# EAGLE schematic Program Counter (EAGLE 9.5.2)
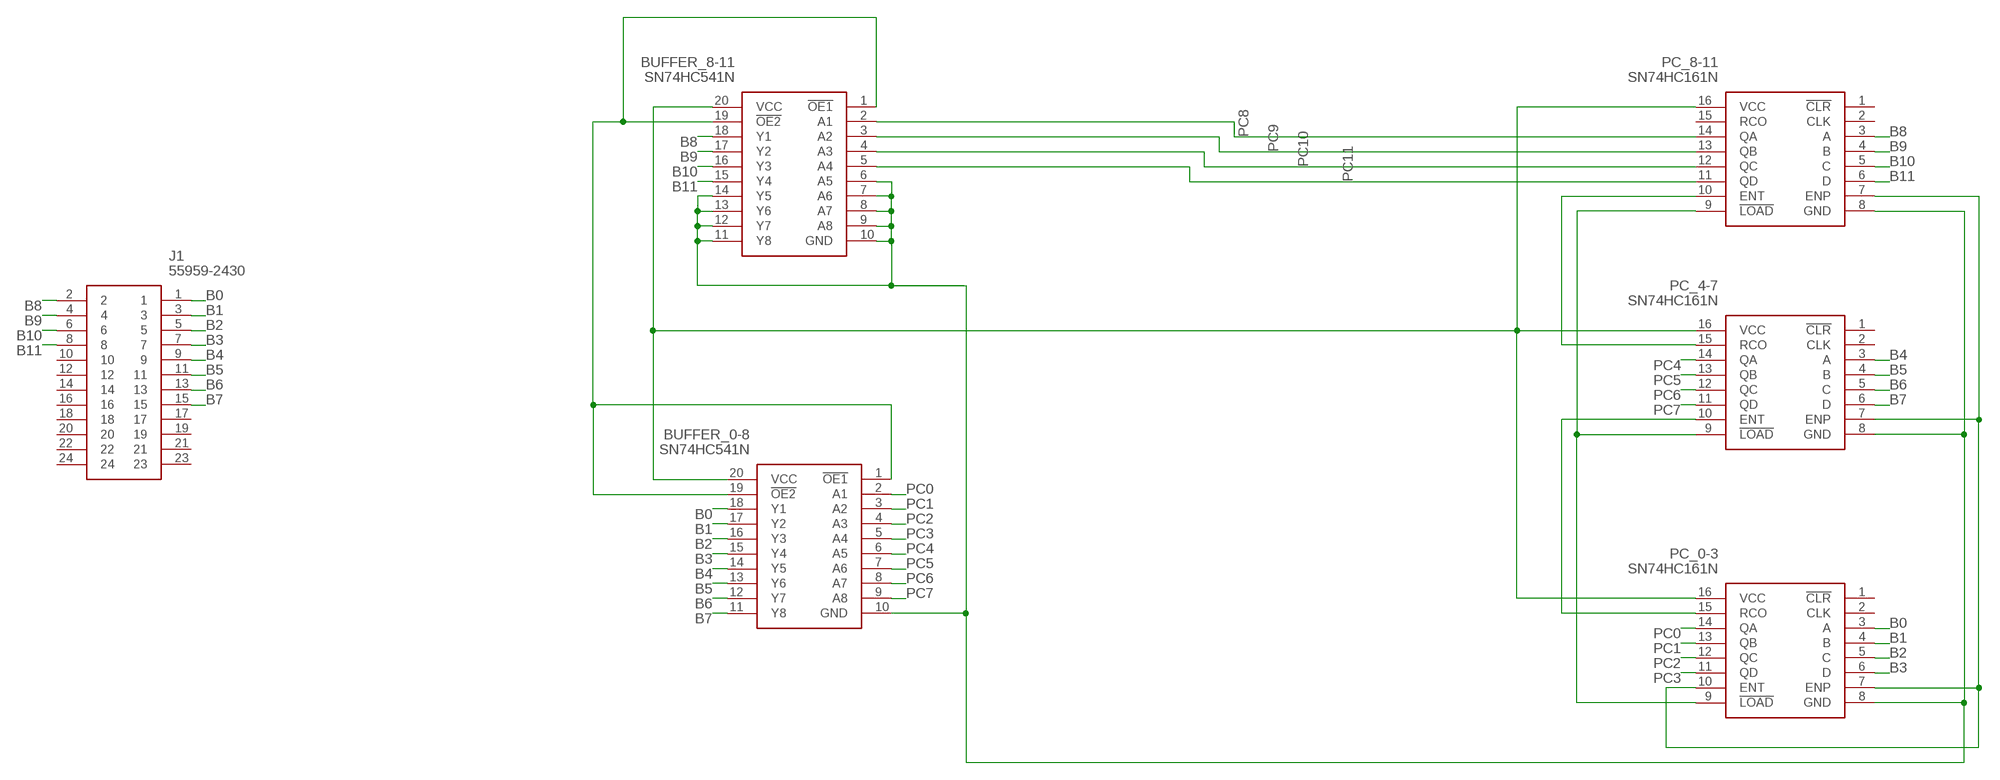
[diagram p0: schematic, sheet 1]

## Parts
BUFFER_0-8  SN74HC541N  [DIP794W53P254L2540H508Q20N]
BUFFER_8-11  SN74HC541N  [DIP794W53P254L2540H508Q20N]
J1  55959-2430  [559592430]
PC_0-3  SN74HC161N  [DIP794W53P254L1930H508Q16N]
PC_4-7  SN74HC161N  [DIP794W53P254L1930H508Q16N]
PC_8-11  SN74HC161N  [DIP794W53P254L1930H508Q16N]

## Nets
B0: BUFFER_0-8.18(Y1) J1.1 PC_0-3.3(A)
B1: BUFFER_0-8.17(Y2) J1.3 PC_0-3.4(B)
B2: BUFFER_0-8.16(Y3) J1.5 PC_0-3.5(C)
B3: BUFFER_0-8.15(Y4) J1.7 PC_0-3.6(D)
B4: BUFFER_0-8.14(Y5) J1.9 PC_4-7.3(A)
B5: BUFFER_0-8.13(Y6) J1.11 PC_4-7.4(B)
B6: BUFFER_0-8.12(Y7) J1.13 PC_4-7.5(C)
B7: BUFFER_0-8.11(Y8) J1.15 PC_4-7.6(D)
B8: BUFFER_8-11.18(Y1) J1.2 PC_8-11.3(A)
B9: BUFFER_8-11.17(Y2) J1.4 PC_8-11.4(B)
B10: BUFFER_8-11.16(Y3) J1.6 PC_8-11.5(C)
B11: BUFFER_8-11.15(Y4) J1.8 PC_8-11.6(D)
N$1: BUFFER_0-8.10(GND) BUFFER_8-11.6(A5) BUFFER_8-11.7(A6) BUFFER_8-11.8(A7) BUFFER_8-11.9(A8) BUFFER_8-11.10(GND) BUFFER_8-11.11(Y8) BUFFER_8-11.12(Y7) BUFFER_8-11.13(Y6) BUFFER_8-11.14(Y5) PC_0-3.8(GND) PC_4-7.8(GND) PC_8-11.8(GND)
N$2: PC_0-3.15(RCO) PC_4-7.10(ENT)
N$3: PC_4-7.15(RCO) PC_8-11.10(ENT)
N$4: BUFFER_0-8.1(!OE1) BUFFER_0-8.19(!OE2) BUFFER_8-11.1(!OE1) BUFFER_8-11.19(!OE2)
N$5: PC_0-3.9(!LOAD) PC_4-7.9(!LOAD) PC_8-11.9(!LOAD)
N$6: PC_0-3.7(ENP) PC_0-3.10(ENT) PC_4-7.7(ENP) PC_8-11.7(ENP)
N$8: BUFFER_0-8.20(VCC) BUFFER_8-11.20(VCC) PC_0-3.16(VCC) PC_4-7.16(VCC) PC_8-11.16(VCC)
PC0: BUFFER_0-8.2(A1) PC_0-3.14(QA)
PC1: BUFFER_0-8.3(A2) PC_0-3.13(QB)
PC2: BUFFER_0-8.4(A3) PC_0-3.12(QC)
PC3: BUFFER_0-8.5(A4) PC_0-3.11(QD)
PC4: BUFFER_0-8.6(A5) PC_4-7.14(QA)
PC5: BUFFER_0-8.7(A6) PC_4-7.13(QB)
PC6: BUFFER_0-8.8(A7) PC_4-7.12(QC)
PC7: BUFFER_0-8.9(A8) PC_4-7.11(QD)
PC8: BUFFER_8-11.2(A1) PC_8-11.14(QA)
PC9: BUFFER_8-11.3(A2) PC_8-11.13(QB)
PC10: BUFFER_8-11.4(A3) PC_8-11.12(QC)
PC11: BUFFER_8-11.5(A4) PC_8-11.11(QD)
Unconnected: J1.10 J1.12 J1.14 J1.16 J1.17 J1.18 J1.19 J1.20 J1.21 J1.22 J1.23 J1.24 PC_0-3.1(!CLR) PC_0-3.2(CLK) PC_4-7.1(!CLR) PC_4-7.2(CLK) PC_8-11.1(!CLR) PC_8-11.2(CLK) PC_8-11.15(RCO)

## Library data of the parts
BUFFER_0-8 BUFFER_8-11 = SamacSys_Parts:SN74HC541N: Octal Buffers And Line Drivers With 3-State Outputs Source: Datasheet <http://componentsearchengine.com/Datasheets/3/SN74HC541N.pdf>; DESCRIPTION: Octal Buffers And Line Drivers With 3-State Outputs; HEIGHT: 5.08mm; MANUFACTURER_NAME: Texas Instruments; MANUFACTURER_PART_NUMBER: SN74HC541N; MOUSER_PART_NUMBER: 595-SN74HC541N; MOUSER_PRICE-STOCK: https://www.mouser.com/Search/Refine.aspx?Keyword=595-SN74HC541N
J1 = SamacSys_Parts:55959-2430: Headers & Wire Housings 24 Ckt R.A. Header Source: Datasheet <https://componentsearchengine.com/Datasheets/1/55959-2430.pdf>; DESCRIPTION: Headers & Wire Housings 24 Ckt R.A. Header; HEIGHT: 11.95mm; MANUFACTURER_NAME: Molex; MANUFACTURER_PART_NUMBER: 55959-2430; MOUSER_PART_NUMBER: 538-55959-2430; MOUSER_PRICE-STOCK: https://www.mouser.com/Search/Refine.aspx?Keyword=538-55959-2430
PC_0-3 PC_4-7 PC_8-11 = SamacSys_Parts:SN74HC161N: SYNCHRONOUS 4-BIT BINARY COUNTERS Source: Datasheet <http://www.ti.com/lit/gpn/sn74hc161>; DESCRIPTION: SYNCHRONOUS 4-BIT BINARY COUNTERS; HEIGHT: 5.08mm; MANUFACTURER_NAME: Texas Instruments; MANUFACTURER_PART_NUMBER: SN74HC161N; MOUSER_PART_NUMBER: 595-SN74HC161N; MOUSER_PRICE-STOCK: https://www.mouser.com/Search/Refine.aspx?Keyword=595-SN74HC161N